# Altium schematic sheet iA-Pmod-AES3-4x4.SchDoc
size A4; CompanyName: imaginary Audio; Organization: imaginary Audio; Address1: 6903 101 Ave NW; Address2: Edmonton; Address3: AB; Address4: T6A 0H6; DocumentNumber: 2; Revision: 0.1; SheetNumber: 2; SheetTotal: 4; Designer: Gabriel Bessette; DocRev: 0.1
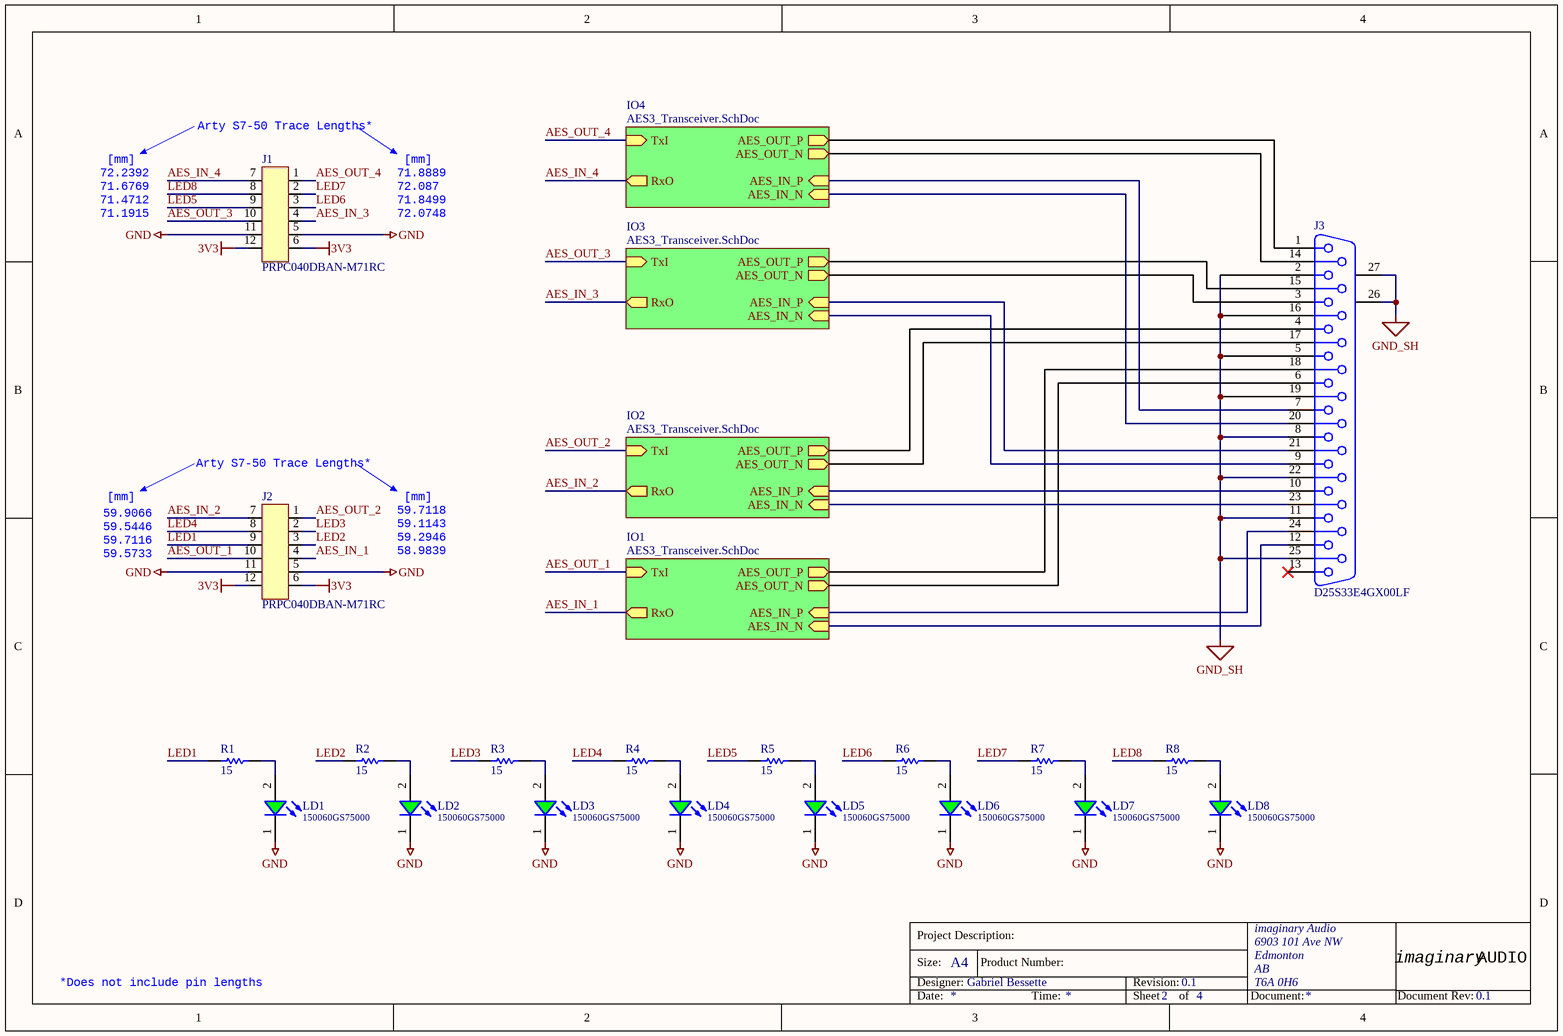
[diagram p0: iA-Pmod-AES3-4x4.SchDoc]

## Parts
J1  PRPC040DBAN-M71RC  [HDRMTH100RA_6x2]
J2  PRPC040DBAN-M71RC  [HDRMTH100RA_6x2]
J3  D25S33E4GX00LF  [D25S33E4GX00LF]
LD1  150060GS75000  [WL-SMCW_0603_H=0.7mm]
LD2  150060GS75000  [WL-SMCW_0603_H=0.7mm]
LD3  150060GS75000  [WL-SMCW_0603_H=0.7mm]
LD4  150060GS75000  [WL-SMCW_0603_H=0.7mm]
LD5  150060GS75000  [WL-SMCW_0603_H=0.7mm]
LD6  150060GS75000  [WL-SMCW_0603_H=0.7mm]
LD7  150060GS75000  [WL-SMCW_0603_H=0.7mm]
LD8  150060GS75000  [WL-SMCW_0603_H=0.7mm]
R1  15  [RESC1608X55X30NL15T15]
R2  15  [RESC1608X55X30NL15T15]
R3  15  [RESC1608X55X30NL15T15]
R4  15  [RESC1608X55X30NL15T15]
R5  15  [RESC1608X55X30NL15T15]
R6  15  [RESC1608X55X30NL15T15]
R7  15  [RESC1608X55X30NL15T15]
R8  15  [RESC1608X55X30NL15T15]

## Sub-sheets
IO1 = AES3_Transceiver.SchDoc: AES_IN_P (in), AES_IN_N (in), AES_OUT_N (out), AES_OUT_P (out), TxI (in), RxO (out)
IO2 = AES3_Transceiver.SchDoc: AES_IN_P (in), AES_IN_N (in), AES_OUT_N (out), AES_OUT_P (out), TxI (in), RxO (out)
IO3 = AES3_Transceiver.SchDoc: AES_IN_P (in), AES_IN_N (in), AES_OUT_N (out), AES_OUT_P (out), TxI (in), RxO (out)
IO4 = AES3_Transceiver.SchDoc: AES_IN_P (in), AES_IN_N (in), AES_OUT_N (out), AES_OUT_P (out), TxI (in), RxO (out)

## Nets
3V3: J1.6 J1.12 J2.6 J2.12
GND: J1.5 J1.11 J2.5 J2.11 LD1.1(K) LD2.1(K) LD3.1(K) LD4.1(K) LD5.1(K) LD6.1(K) LD7.1(K) LD8.1(K)
GND_SH: J3.2 J3.5 J3.8 J3.11 J3.16 J3.19 J3.22 J3.25 J3.26(MH1) J3.27(MH2)
AES_IN_1: J2.4 ; sheet IO1/RxO
AES_IN_2: J2.7 ; sheet IO2/RxO
AES_IN_3: J1.4 ; sheet IO3/RxO
AES_IN_4: J1.7 ; sheet IO4/RxO
AES_OUT_1: J2.10 ; sheet IO1/TxI
AES_OUT_2: J2.1 ; sheet IO2/TxI
AES_OUT_3: J1.10 ; sheet IO3/TxI
AES_OUT_4: J1.1 ; sheet IO4/TxI
LED1: J2.9 R1.1
LED2: J2.3 R2.1
LED3: J2.2 R3.1
LED4: J2.8 R4.1
LED5: J1.9 R5.1
LED6: J1.3 R6.1
LED7: J1.2 R7.1
LED8: J1.8 R8.1
NetJ3_1: J3.1 ; sheet IO4/AES_OUT_P
NetJ3_3: J3.3 ; sheet IO3/AES_OUT_N
NetJ3_4: J3.4 ; sheet IO2/AES_OUT_P
NetJ3_6: J3.6 ; sheet IO1/AES_OUT_N
NetJ3_7: J3.7 ; sheet IO4/AES_IN_P
NetJ3_9: J3.9 ; sheet IO3/AES_IN_N
NetJ3_10: J3.10 ; sheet IO2/AES_IN_P
NetJ3_12: J3.12 ; sheet IO1/AES_IN_N
NetJ3_14: J3.14 ; sheet IO4/AES_OUT_N
NetJ3_15: J3.15 ; sheet IO3/AES_OUT_P
NetJ3_17: J3.17 ; sheet IO2/AES_OUT_N
NetJ3_18: J3.18 ; sheet IO1/AES_OUT_P
NetJ3_20: J3.20 ; sheet IO4/AES_IN_N
NetJ3_21: J3.21 ; sheet IO3/AES_IN_P
NetJ3_23: J3.23 ; sheet IO2/AES_IN_N
NetJ3_24: J3.24 ; sheet IO1/AES_IN_P
NetLD1_2: LD1.2(A) R1.2
NetLD2_2: LD2.2(A) R2.2
NetLD3_2: LD3.2(A) R3.2
NetLD4_2: LD4.2(A) R4.2
NetLD5_2: LD5.2(A) R5.2
NetLD6_2: LD6.2(A) R6.2
NetLD7_2: LD7.2(A) R7.2
NetLD8_2: LD8.2(A) R8.2

Not connected (* = marked no-connect by the designer): J3 13*

## Notes on the sheet
- 72.2392
- [mm]
- (near J1) Arty S7-50 Trace Lengths*
- 71.8889
- 71.6769
- 71.4712
- 71.1915
- 72.087
- 71.8499
- 72.0748
- 59.9066
- (near J2) Arty S7-50 Trace Lengths*
- 59.7118
- 59.5446
- 59.7116
- 59.5733
- 59.1143
- 59.2946
- 58.9839
- *Does not include pin lengths
- Project Description:
- Size:
- Designer:
- A4
- Product Number:
- Revision:
- imaginary
- AUDIO
- Date:
- Time:
- Sheet
- of
- Document:
- Document Rev:

## Library data of the parts
J1 J2 = HDRMTH100RA_6X2: CONN HEADER .100 DUAL R/A 80POS; Manufacturer: Sullins; Number of Positions: 80; Connector Type: Male Pin; Pitch: 0.1inch; Supplier 1: Digi-Key; Supplier Part Number 1: S2111EC-40-ND; Manufacturer Part Number: PRPC040DBAN-M71RC; RoHS: Yes; Category: Connectors; Stock 1: 9670; Pricing 1: 1=2.43000, 10=2.17100, 100=1.78790, 500=1.41332, 1000=1.22980 (USD); Mount: Through Hole; Contact Plating: Gold; Color: Black; Termination: Solder; Package Quantity: 1; Number of Rows: 2; Packaging: Bulk; Row Spacing: 0.1inch; Contact Mating Length: 0.23inch; Lead Free: Lead Free; ComponentLink1URL: https://datasheet.ciiva.com/16477/prpc040sban-m71rc-16477642.pdf?src-supplier=Future+Electronics; ComponentLink1Description: https://datasheet.ciiva.com/16477/prpc040sban-m71rc-16477642.pdf?src-supplier=Future+Electronics; ComponentLink2URL: https://datasheet.ciiva.com/741/xrxczzzdxxn-m71rc-11639-b-741645.pdf?src-supplier=Digi-Key; ComponentLink2Description: https://datasheet.ciiva.com/741/xrxczzzdxxn-m71rc-11639-b-741645.pdf?src-supplier=Digi-Key
J3 = D25S33E4GX00LF: CONN, D-SUB RCPT 25POS R/A SOLDER; Manufacturer: Amphenol FCI; Gender: Receptacle; Connector Type: D-Sub,Receptacle,Signal; Voltage Rating: 300V; Current Rating: 5A; Number of Positions: 25; Number of Ports: 1; Pitch: 2.84mm; Body Material: Metal; Mating Cycles: 200; PackageDocument: U; Plating: Tin,Bright; Supplier 1: Digi-Key; Supplier Part Number 1: 609-1511-ND; RoHS: Yes; Category: D-Sub Connectors; Stock 1: 371; Pricing 1: 1=2.14000, 10=1.93800, 25=1.81920, 50=1.74020, 100=1.66110, 250=1.50292, 500=1.38426, 1000=1.18650, 2500=1.10740 (USD); Manufacturer Part Number: D25S33E4GX00LF; Publisher: Altium Limited; Orientation: Right Angle; Mount: Through Hole; Case/Package: Metal; Contact Plating: Gold,Tin,Matte; Housing Material: PBT; Color: Black; Contact Material: Copper Alloy; Number of Terminals: 25; Min Operating Temperature: -55°C; Max Operating Temperature: 125°C; Packaging: Tray; Number of Rows: 2; Termination: Solder; Number of Contacts: 25; Package Quantity: 20; Max Voltage Rating (AC): 300V; Length: 53.03mm; Depth: 18.77mm; Width: 12.55mm; Radiation Hardening: No; REACH SVHC: No SVHC; Lead Free: Lead Free; Flammability Rating: UL94 V-0; ComponentLink1URL: https://datasheet.ciiva.com/15177/getdatasheetpartid-136448-15177660.pdf?src-supplier=Verical; ComponentLink1Description: https://datasheet.ciiva.com/15177/getdatasheetpartid-136448-15177660.pdf?src-supplier=Verical; ComponentLink2URL: https://datasheet.ciiva.com/16662/c01-8646-0823-16662565.pdf?src-supplier=Avnet+Europe; ComponentLink2Description: https://datasheet.ciiva.com/16662/c01-8646-0823-16662565.pdf?src-supplier=Avnet+Europe; ComponentLink3URL: https://datasheet.ciiva.com/658/c01-8646-0146-658755.pdf?src-supplier=Digi-Key; ComponentLink3Description: https://datasheet.ciiva.com/658/c01-8646-0146-658755.pdf?src-supplier=Digi-Key; Supplier 2: Mouser; Supplier Part Number 2: 649-D25S33E4GX00LF; DatasheetDocument: 19-Mar-1999; Housing Color: Black; LatestRevisionDate: 17-Jul-2002; LatestRevisionNote: Re-released for DXP Platform.; Max Supply Voltage (AC): 300V; PackageReference: 787202; Positions: 25; Published: 15-Jun-2001
LD1-LD8 = 150060GS75000: WURTH ELEKTRONIK - 150060GS75000 - LED, Green, 520 nm, 3.2 V, 30 mA, 430 mcd RoHS Compliant: Yes; Manufacturer: Wurth Electronics; Viewing Angle: 140deg; Chip Technology: InGaN; Dominant Wavelength typ.: 525nm; Forward Voltage typ.: 3.2V; Luminous Intensity typ.: 430mcd; Peak Wavelength typ.: 515nm; Wavelength: 520nm; Lens Style: Clear,Rectangular; Forward Current: 30mA; Test Current: 20mA; ComponentLink1Description: Manufacturer; ComponentLink1URL: http://www.we-online.de; ComponentLink2URL: https://www.we-online.com/catalog/datasheet/150060GS75000.pdf; ComponentLink2Description: Datasheet; Emitting Color: Green; Mounting Technology: SMT; Operating Temperature: -40 to +85degC; Published Date: December 2019; Part Number: 150060GS75000; Packaging: Tape and Reel; Size: 0603; Publisher: Wurth Elektronik; Supplier 1: Digi-Key; Supplier Part Number 1: 732-4971-1-ND; RoHS: Yes; Category: LEDs; Stock 1: 95740; Pricing 1: 1=0.14000, 50=0.13300, 100=0.11400, 500=0.09900 (USD); Mount: Surface Mount; Case/Package: 0603; Color: Green; Case Code (Metric): 1608; Case Code (Imperial): 0603; Min Operating Temperature: -40°C; Max Operating Temperature: 85°C; Package Quantity: 4000; Luminous Intensity: 430mcd; Forward Voltage: 3.2V; Dominant Wavelength: 520nm; Length: 1.6mm; Width: 0.8mm; Height: 0.7mm; REACH SVHC: Unknown; Lead Free: Lead Free; ComponentLink3URL: https://datasheet.ciiva.com/29562/150060gs75000-29562868.pdf?src-supplier=Digi-Key; ComponentLink3Description: https://datasheet.ciiva.com/29562/150060gs75000-29562868.pdf?src-supplier=Digi-Key; ComponentLink4URL: https://datasheet.ciiva.com/29279/759427-da-01-en-chipled-0603-w-kl-gruen-150060gs75000-29279201.pdf?src-supplier=Conrad; ComponentLink4Description: https://datasheet.ciiva.com/29279/759427-da-01-en-chipled-0603-w-kl-gruen-150060gs75000-29279201.pdf?src-supplier=Conrad; ComponentLink5URL: https://datasheet.ciiva.com/29562/150060gs75000-29562870.pdf?src-supplier=Digi-Key; ComponentLink5Description: https://datasheet.ciiva.com/29562/150060gs75000-29562870.pdf?src-supplier=Digi-Key; ComponentLink6URL: https://datasheet.ciiva.com/29562/150060gs75000-29562869.pdf?src-supplier=Digi-Key; ComponentLink6Description: https://datasheet.ciiva.com/29562/150060gs75000-29562869.pdf?src-supplier=Digi-Key; Supplier 2: Mouser; Supplier Part Number 2: 710-150060GS75000; Manufacturer Part Number: 150060GS75000
R1-R8 = RES: Res Thick Film 0603 15 Ohm 1% 1/10W ±100ppm/°C Molded SMD Punched Carrier T/R; Manufacturer Part Number: ERJ-3EKF15R0V; Resistance: 15R; Power Rating: 100mW; Voltage Rating: 75V; Value: 15; Supplier 1: Digi-Key; Supplier Part Number 1: P15.0HCT-ND; RoHS: Yes; Category: Chip SMD Resistors; Stock 1: 4368; Pricing 1: 1=0.10000, 10=0.03200, 100=0.01300, 1000=0.00583, 2500=0.00506 (USD); Mount: Surface Mount; Case/Package: 0603; Number of Pins: 2; Case Code (Metric): 1608; Case Code (Imperial): 0603; Weight: 7.1E-05oz; Contact Plating: Tin; Min Operating Temperature: -55°C; Max Operating Temperature: 155°C; Packaging: Tape and Reel; Tolerance: 1%; Package Quantity: 1; Resistor Type: Thick Film; Number of Terminations: 2; Termination: SMD/SMT; Temperature Coefficient: 100ppm/°C; Max Power Dissipation: 100mW; Voltage Rating (DC): 75V; Working Voltage: 75V; Features: Automotive AEC-Q200; Length: 1.6mm; Width: 0.031inch; Height: 0.022inch; Depth: 0.8mm; Radiation Hardening: No; REACH SVHC: No SVHC; Military Standard: Not; Lead Free: Lead Free; ComponentLink1URL: https://datasheet.ciiva.com/46373/1678782-46373800.pdf?src-supplier=Element14; ComponentLink1Description: https://datasheet.ciiva.com/46373/1678782-46373800.pdf?src-supplier=Element14; ComponentLink2URL: https://datasheet.ciiva.com/5915/aoa0000ce2-5915293.pdf?src-supplier=Farnell; ComponentLink2Description: https://datasheet.ciiva.com/5915/aoa0000ce2-5915293.pdf?src-supplier=Farnell; ComponentLink3URL: https://datasheet.ciiva.com/22682/1678782-22682189.pdf?src-supplier=Element14; ComponentLink3Description: https://datasheet.ciiva.com/22682/1678782-22682189.pdf?src-supplier=Element14; ComponentLink4URL: https://datasheet.ciiva.com/46373/1678782-46373801.pdf?src-supplier=Element14; ComponentLink4Description: https://datasheet.ciiva.com/46373/1678782-46373801.pdf?src-supplier=Element14; ComponentLink5URL: https://datasheet.ciiva.com/16770/70260748-16770860.pdf?src-supplier=Allied+Electronics; ComponentLink5Description: https://datasheet.ciiva.com/16770/70260748-16770860.pdf?src-supplier=Allied+Electronics; ComponentLink6URL: https://datasheet.ciiva.com/30238/aoa0000ce2-30238940.pdf?src-supplier=Onlinecomponents.com; ComponentLink6Description: https://datasheet.ciiva.com/30238/aoa0000ce2-30238940.pdf?src-supplier=Onlinecomponents.com; ComponentLink7URL: https://datasheet.ciiva.com/9192/aoa0000ce2-9192958.pdf?src-supplier=Avnet; ComponentLink7Description: https://datasheet.ciiva.com/9192/aoa0000ce2-9192958.pdf?src-supplier=Avnet